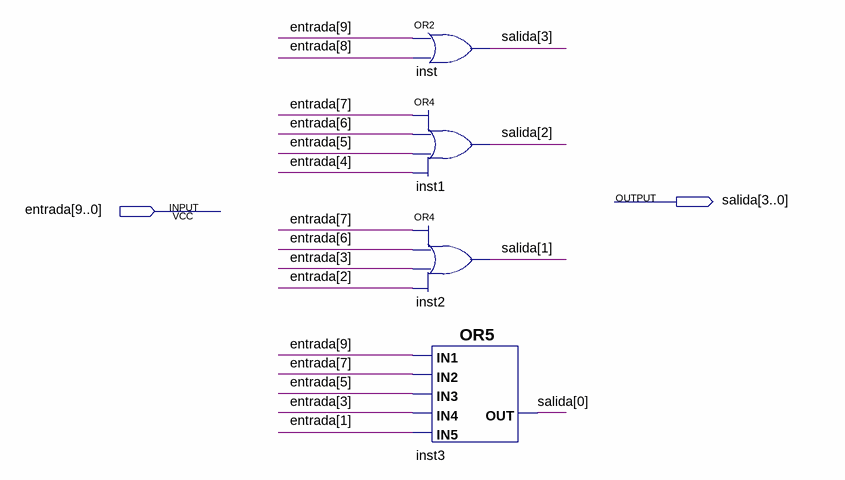
[diagram p0: schematic sheet]
// Quartus schematic switchesToBCD.bdf as structural Verilog: 4 symbols, 2 pins
module switchesToBCD (
  input  [9:0] entrada,
  output [3:0] salida
);

  or inst (salida[3], entrada[9], entrada[8]);
  or inst1 (salida[2], entrada[7], entrada[6], entrada[5], entrada[4]);
  or inst2 (salida[1], entrada[7], entrada[6], entrada[3], entrada[2]);
  or inst3 (salida[0], entrada[9], entrada[7], entrada[5], entrada[3], entrada[1]);
endmodule
